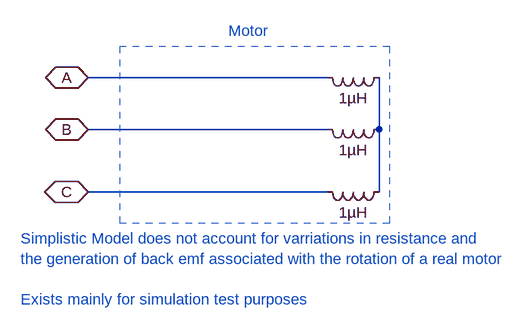
[diagram p0: schematic Simple_Motor.asc]
Simple_Motor.asc, the LTspice schematic file:
Version 4
SHEET 1 880 680
WIRE 272 -48 -96 -48
WIRE 272 32 -96 32
WIRE 352 32 352 -48
WIRE 272 128 -96 128
WIRE 352 128 352 32
FLAG -96 -48 A
IOPIN -96 -48 BiDir
FLAG -96 32 B
IOPIN -96 32 BiDir
FLAG -96 128 C
IOPIN -96 128 BiDir
SYMBOL ind 368 -64 R90
WINDOW 0 5 56 Invisible 2
WINDOW 3 32 56 VTop 2
SYMATTR InstName L1
SYMATTR Value 1µH
SYMATTR SpiceLine Ipk=0.8 Rser=0.01
SYMBOL ind 368 16 R90
WINDOW 0 5 56 Invisible 2
WINDOW 3 32 56 VTop 2
SYMATTR InstName L2
SYMATTR Value 1µH
SYMATTR SpiceLine Ipk=0.8 Rser=0.01
SYMBOL ind 368 112 R90
WINDOW 0 5 56 Invisible 2
WINDOW 3 32 56 VTop 2
SYMATTR InstName L3
SYMATTR Value 1µH
SYMATTR SpiceLine Ipk=0.8 Rser=0.01
TEXT 120 -120 Left 2 ;Motor
TEXT -200 200 Left 2 ;Simplistic Model does not account for varriations in resistance and \nthe generation of back emf associated with the rotation of a real motor\n \nExists mainly for simulation test purposes
RECTANGLE Normal 368 -96 -48 176 2

The netlist it stands for:
* Simple_Motor.asc
L1 N001 A 1µH Ipk=0.8 Rser=0.01
L2 N001 B 1µH Ipk=0.8 Rser=0.01
L3 N001 C 1µH Ipk=0.8 Rser=0.01
* Motor
* Simplistic Model does not account for varriations in resistance and
* the generation of back emf associated with the rotation of a real motor
* Exists mainly for simulation test purposes
.backanno
.end